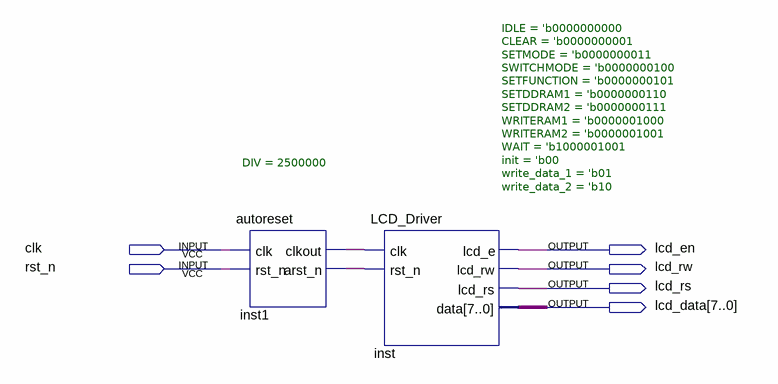
[diagram p0: schematic sheet]
// Quartus schematic LCD1602.bdf as structural Verilog: 2 symbols, 6 pins
module LCD1602 (
  input  clk,
  input  rst_n,
  output lcd_en,
  output lcd_rw,
  output lcd_rs,
  output [7:0] lcd_data
);

  wire inst1_arst_n, inst1_clkout;

  autoreset #(.DIV(2500000)) inst1 (.clk(clk), .rst_n(rst_n), .clkout(inst1_clkout), .arst_n(inst1_arst_n));
  LCD_Driver #(.IDLE('b0000000000), .CLEAR('b0000000001), .SETMODE('b0000000011), .SWITCHMODE('b0000000100), .SETFUNCTION('b0000000101), .SETDDRAM1('b0000000110), .SETDDRAM2('b0000000111), .WRITERAM1('b0000001000), .WRITERAM2('b0000001001), .WAIT('b1000001001), .init('b00), .write_data_1('b01), .write_data_2('b10)) inst (
    .clk(inst1_clkout), .rst_n(inst1_arst_n), .lcd_e(lcd_en), .lcd_rw(lcd_rw), .lcd_rs(lcd_rs),
    .data(lcd_data));
endmodule
